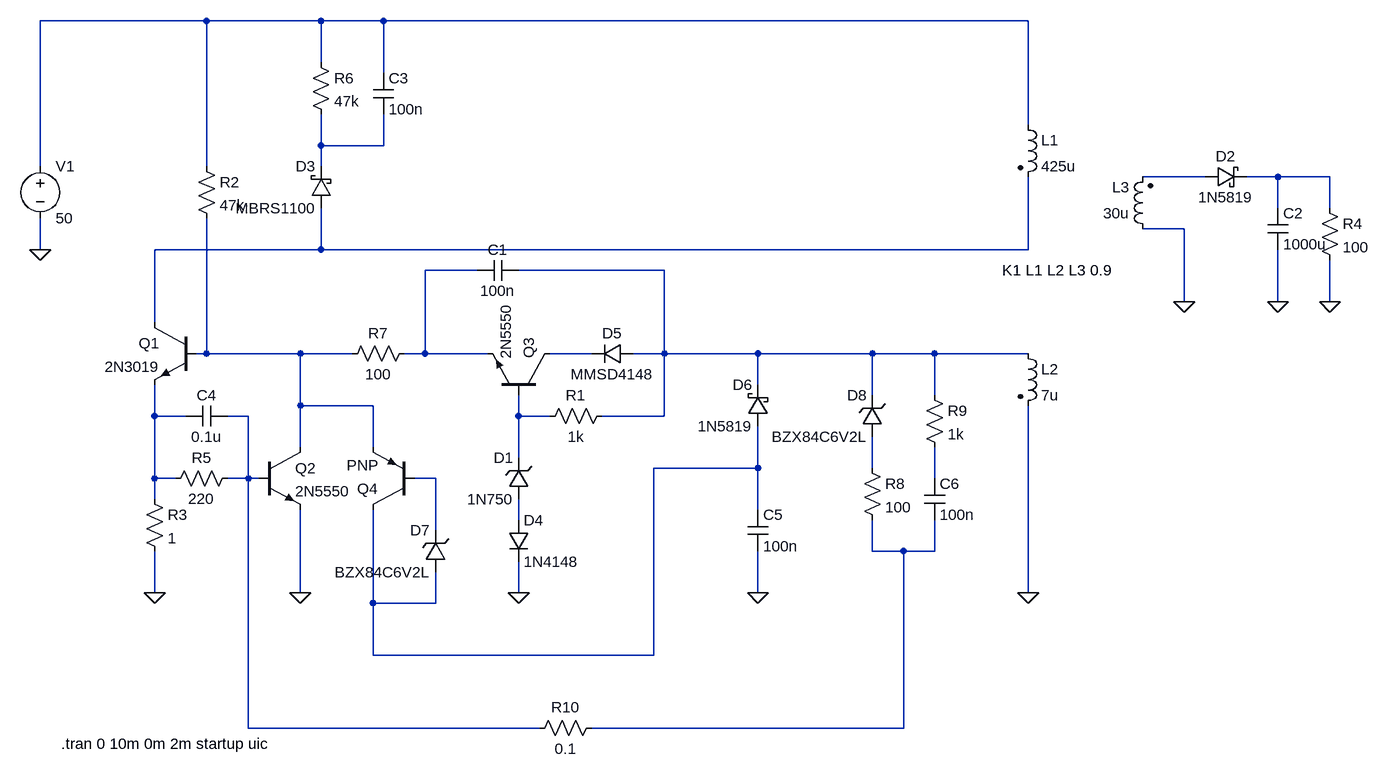
[diagram p0: schematic RCC.asc]
RCC.asc, the LTspice schematic file:
Version 4
SHEET 1 1848 920
WIRE 48 -240 -208 -240
WIRE 224 -240 48 -240
WIRE 320 -240 224 -240
WIRE 1312 -240 320 -240
WIRE 224 -176 224 -240
WIRE 320 -160 320 -240
WIRE 1312 -80 1312 -240
WIRE 224 -48 224 -96
WIRE 320 -48 320 -96
WIRE 320 -48 224 -48
WIRE -208 -16 -208 -240
WIRE 48 -16 48 -240
WIRE 224 -16 224 -48
WIRE 1584 0 1488 0
WIRE 1696 0 1648 0
WIRE 1776 0 1696 0
WIRE 1696 48 1696 0
WIRE 1776 48 1776 0
WIRE 1552 80 1488 80
WIRE -208 112 -208 64
WIRE 224 112 224 48
WIRE 224 112 -32 112
WIRE 1312 112 1312 0
WIRE 1312 112 224 112
WIRE 464 144 384 144
WIRE 752 144 528 144
WIRE 1552 192 1552 80
WIRE 1696 192 1696 112
WIRE 1776 192 1776 128
WIRE -32 224 -32 112
WIRE 48 272 48 64
WIRE 48 272 32 272
WIRE 192 272 48 272
WIRE 272 272 192 272
WIRE 384 272 384 144
WIRE 384 272 352 272
WIRE 480 272 384 272
WIRE 640 272 576 272
WIRE 752 272 752 144
WIRE 752 272 704 272
WIRE 896 272 752 272
WIRE 1072 272 896 272
WIRE 1168 272 1072 272
WIRE 1312 272 1168 272
WIRE 896 320 896 272
WIRE 1072 336 1072 272
WIRE 1168 336 1168 272
WIRE 192 352 192 272
WIRE 304 352 192 352
WIRE -32 368 -32 320
WIRE 16 368 -32 368
WIRE 112 368 80 368
WIRE 528 368 528 336
WIRE 576 368 528 368
WIRE 752 368 752 272
WIRE 752 368 656 368
WIRE 192 416 192 352
WIRE 304 416 304 352
WIRE 528 432 528 368
WIRE 896 448 896 384
WIRE 896 448 736 448
WIRE 1072 448 1072 400
WIRE -32 464 -32 368
WIRE 0 464 -32 464
WIRE 112 464 112 368
WIRE 112 464 80 464
WIRE 128 464 112 464
WIRE 400 464 368 464
WIRE 1168 464 1168 416
WIRE -32 496 -32 464
WIRE 896 512 896 448
WIRE 528 528 528 496
WIRE 400 544 400 464
WIRE 1072 576 1072 528
WIRE 1120 576 1072 576
WIRE 1168 576 1168 528
WIRE 1168 576 1120 576
WIRE -32 640 -32 576
WIRE 192 640 192 512
WIRE 528 640 528 592
WIRE 896 640 896 576
WIRE 1312 640 1312 352
WIRE 304 656 304 512
WIRE 400 656 400 608
WIRE 400 656 304 656
WIRE 304 736 304 656
WIRE 736 736 736 448
WIRE 736 736 304 736
WIRE 112 848 112 464
WIRE 560 848 112 848
WIRE 1120 848 1120 576
WIRE 1120 848 640 848
FLAG -208 112 0
FLAG 1312 640 0
FLAG -32 640 0
FLAG 1552 192 0
FLAG 1696 192 0
FLAG 1776 192 0
FLAG 192 640 0
FLAG 528 640 0
FLAG 896 640 0
SYMBOL ind2 1296 -96 R0
SYMATTR InstName L1
SYMATTR Type ind
SYMATTR Value 425u
SYMBOL ind2 1296 256 R0
SYMATTR InstName L2
SYMATTR Type ind
SYMATTR Value 7u
SYMBOL ind2 1504 96 R180
WINDOW 0 36 80 Left 2
WINDOW 3 36 40 Left 2
SYMATTR InstName L3
SYMATTR Value 30u
SYMATTR Type ind
SYMBOL voltage -208 -32 R0
WINDOW 123 0 0 Left 2
WINDOW 39 0 0 Left 2
SYMATTR InstName V1
SYMATTR Value 50
SYMBOL npn 32 224 M0
SYMATTR InstName Q1
SYMATTR Value 2N3019
SYMBOL res 32 -32 R0
SYMATTR InstName R2
SYMATTR Value 47k
SYMBOL res -48 480 R0
SYMATTR InstName R3
SYMATTR Value 1
SYMBOL schottky 1584 16 R270
WINDOW 0 32 32 VTop 2
WINDOW 3 0 32 VBottom 2
SYMATTR InstName D2
SYMATTR Value 1N5819
SYMATTR Description Diode
SYMATTR Type diode
SYMBOL cap 1680 48 R0
SYMATTR InstName C2
SYMATTR Value 1000u
SYMBOL res 1760 32 R0
SYMATTR InstName R4
SYMATTR Value 100
SYMBOL npn 128 416 R0
SYMATTR InstName Q2
SYMATTR Value 2N5550
SYMBOL res 96 448 R90
WINDOW 0 0 56 VBottom 2
WINDOW 3 32 56 VTop 2
SYMATTR InstName R5
SYMATTR Value 220
SYMBOL res 208 -192 R0
SYMATTR InstName R6
SYMATTR Value 47k
SYMBOL schottky 240 48 R180
WINDOW 0 24 64 Left 2
WINDOW 3 24 0 Left 2
SYMATTR InstName D3
SYMATTR Value MBRS1100
SYMATTR Description Diode
SYMATTR Type diode
SYMBOL cap 304 -160 R0
SYMATTR InstName C3
SYMATTR Value 100n
SYMBOL npn 576 336 M270
SYMATTR InstName Q3
SYMATTR Value 2N5550
SYMBOL zener 544 496 R180
WINDOW 0 24 64 Left 2
WINDOW 3 24 0 Left 2
SYMATTR InstName D1
SYMATTR Value 1N750
SYMATTR Description Diode
SYMATTR Type diode
SYMBOL diode 512 528 R0
SYMATTR InstName D4
SYMATTR Value 1N4148
SYMBOL res 672 352 R90
WINDOW 0 0 56 VBottom 2
WINDOW 3 32 56 VTop 2
SYMATTR InstName R1
SYMATTR Value 1k
SYMBOL res 368 256 R90
WINDOW 0 0 56 VBottom 2
WINDOW 3 32 56 VTop 2
SYMATTR InstName R7
SYMATTR Value 100
SYMBOL cap 528 128 R90
WINDOW 0 0 32 VBottom 2
WINDOW 3 32 32 VTop 2
SYMATTR InstName C1
SYMATTR Value 100n
SYMBOL diode 704 256 R90
WINDOW 0 0 32 VBottom 2
WINDOW 3 32 32 VTop 2
SYMATTR InstName D5
SYMATTR Value MMSD4148
SYMBOL cap 80 352 R90
WINDOW 0 0 32 VBottom 2
WINDOW 3 32 32 VTop 2
SYMATTR InstName C4
SYMATTR Value 0.1u
SYMBOL schottky 912 384 R180
WINDOW 0 24 64 Left 2
WINDOW 3 24 0 Left 2
SYMATTR InstName D6
SYMATTR Value 1N5819
SYMATTR Description Diode
SYMATTR Type diode
SYMBOL cap 880 512 R0
SYMATTR InstName C5
SYMATTR Value 100n
SYMBOL pnp 368 512 R180
SYMATTR InstName Q4
SYMBOL zener 416 608 R180
WINDOW 0 24 64 Left 2
WINDOW 3 24 0 Left 2
SYMATTR InstName D7
SYMATTR Value BZX84C6V2L
SYMATTR Description Diode
SYMATTR Type diode
SYMBOL zener 1088 400 R180
WINDOW 0 24 64 Left 2
WINDOW 3 24 0 Left 2
SYMATTR InstName D8
SYMATTR Value BZX84C6V2L
SYMATTR Description Diode
SYMATTR Type diode
SYMBOL res 1056 432 R0
SYMATTR InstName R8
SYMATTR Value 100
SYMBOL res 1152 320 R0
SYMATTR InstName R9
SYMATTR Value 1k
SYMBOL cap 1152 464 R0
SYMATTR InstName C6
SYMATTR Value 100n
SYMBOL res 656 832 R90
WINDOW 0 0 56 VBottom 2
WINDOW 3 32 56 VTop 2
SYMATTR InstName R10
SYMATTR Value 0.1
TEXT 1272 144 Left 2 !K1 L1 L2 L3 0.9
TEXT -176 872 Left 2 !.tran 0 10m 0m 2m startup uic

The netlist it stands for:
* RCC.asc
L1 N001 N005 425u
L2 N007 0 7u
L3 0 N003 30u
V1 N001 0 50
Q1 N005 N008 N010 0 2N3019
R2 N001 N008 47k
R3 N010 0 1
D2 N003 N004 1N5819
C2 N004 0 1000u
R4 N004 0 100
Q2 N008 N011 0 0 2N5550
R5 N011 N010 220
R6 N001 N002 47k
D3 N005 N002 MBRS1100
C3 N001 N002 100n
Q3 N009 N012 N006 0 2N5550
D1 N017 N012 1N750
D4 N017 0 1N4148
R1 N007 N012 1k
R7 N006 N008 100
C1 N007 N006 100n
D5 N007 N009 MMSD4148
C4 N011 N010 0.1u
D6 N013 N007 1N5819
C5 N013 0 100n
Q4 N013 N015 N008 0 PNP
D7 N013 N015 BZX84C6V2L
D8 N014 N007 BZX84C6V2L
R8 N014 N018 100
R9 N007 N016 1k
C6 N016 N018 100n
R10 N018 N011 0.1
.model D D
.lib standard.dio
.model NPN NPN
.model PNP PNP
.lib standard.bjt
K1 L1 L2 L3 0.9
.tran 0 10m 0m 2m startup uic
.backanno
.end